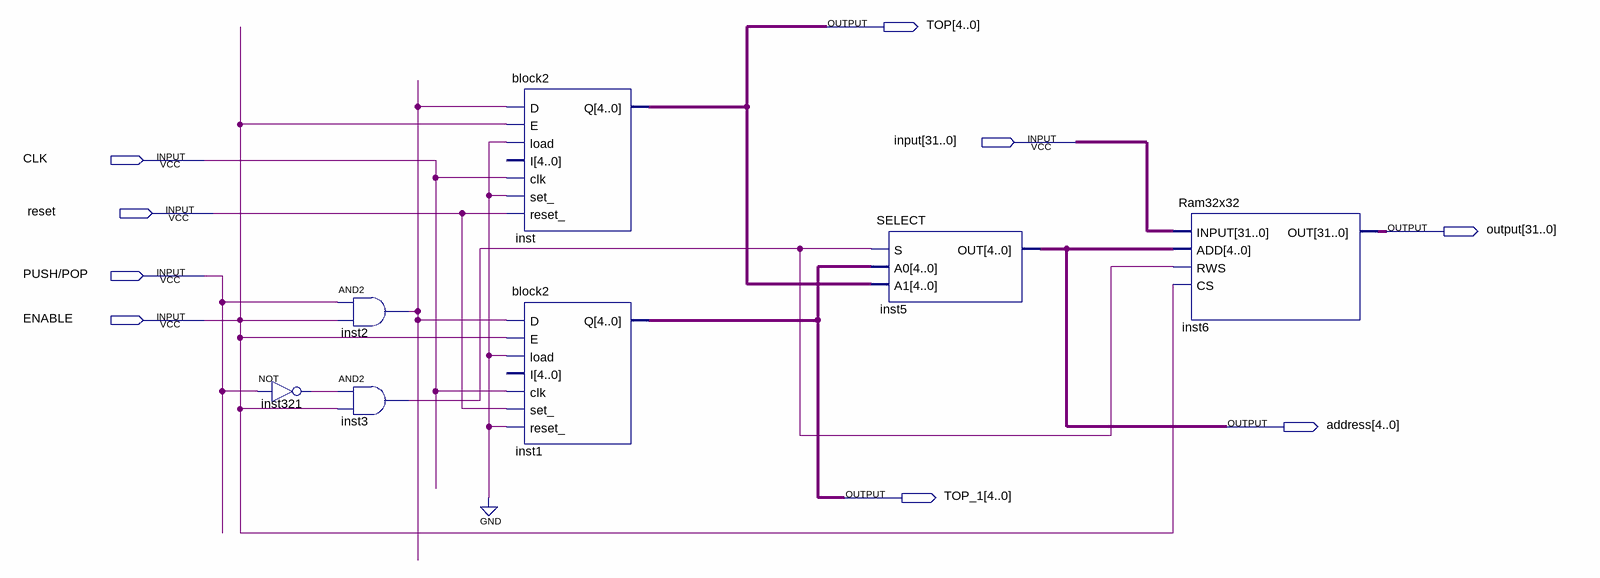
[diagram p0: schematic sheet]
// Quartus schematic STACK.bdf as structural Verilog: 7 symbols, 9 pins
module STACK (
  input  [31:0] \input ,
  input  CLK,
  input  reset,
  input  \PUSH/POP ,
  input  ENABLE,
  output [4:0] TOP,
  output [31:0] \output ,
  output [4:0] address,
  output [4:0] TOP_1
);

  wire inst2_out, inst3_out, inst321_out;

  not inst321 (inst321_out, \PUSH/POP );
  and inst2 (inst2_out, \PUSH/POP , ENABLE);
  and inst3 (inst3_out, inst321_out, ENABLE);
  block2 inst (.D(inst2_out), .E(ENABLE), .load(1'b0), .clk(CLK), .set_(1'b0), .reset_(reset), .Q(TOP));  // open: I
  block2 inst1 (.D(inst2_out), .E(ENABLE), .load(1'b0), .clk(CLK), .set_(reset), .reset_(1'b0), .Q(TOP_1));  // open: I
  SELECT inst5 (.S(inst3_out), .A0(TOP_1), .A1(TOP), .OUT(address));
  Ram32x32 inst6 (.INPUT(\input ), .ADD(address), .RWS(inst3_out), .CS(ENABLE), .OUT(\output ));
endmodule
